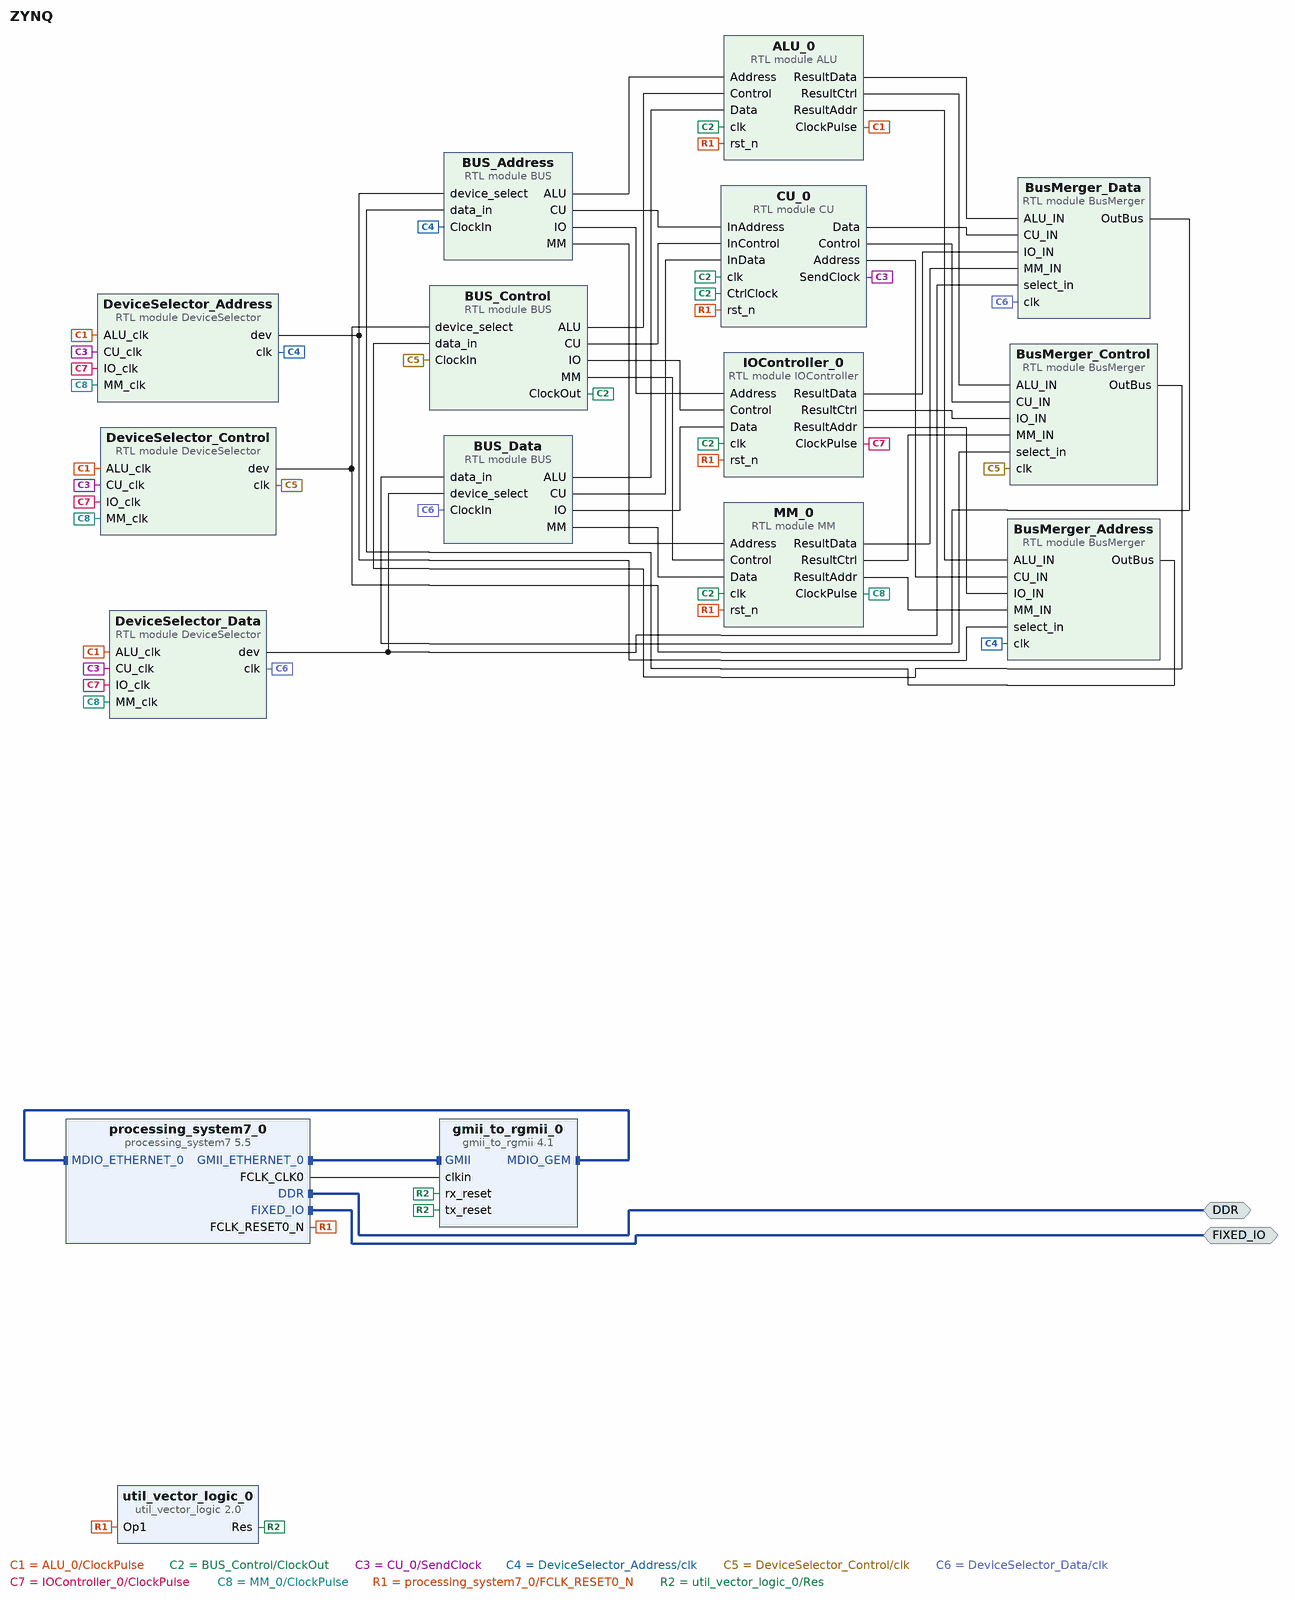
[diagram p0: block diagram of the top level]
# Vivado block design ZYNQ, xc7z020clg484-1, Vivado 2024.1
create_bd_design ZYNQ

create_bd_intf_port -mode Master -vlnv xilinx.com:interface:ddrx_rtl:1.0 DDR
create_bd_intf_port -mode Master -vlnv xilinx.com:display_processing_system7:fixedio_rtl:1.0 FIXED_IO

create_bd_cell -type ip -vlnv xilinx.com:ip:gmii_to_rgmii:4.1 gmii_to_rgmii_0
set_property -dict {CONFIG.SupportLevel Include_Shared_Logic_in_Core} [get_bd_cells gmii_to_rgmii_0]
create_bd_cell -type ip -vlnv xilinx.com:ip:processing_system7:5.5 processing_system7_0
set_property -dict [list \
  CONFIG.PCW_APU_PERIPHERAL_FREQMHZ 666.666666 \
  CONFIG.PCW_ENET0_ENET0_IO EMIO \
  CONFIG.PCW_ENET0_GRP_MDIO_ENABLE 1 \
  CONFIG.PCW_ENET0_GRP_MDIO_IO EMIO \
  CONFIG.PCW_ENET0_PERIPHERAL_ENABLE 1 \
  CONFIG.PCW_ENET1_PERIPHERAL_CLKSRC External \
  CONFIG.PCW_ENET_RESET_ENABLE 0 \
  CONFIG.PCW_FPGA0_PERIPHERAL_FREQMHZ 200 \
  CONFIG.PCW_FPGA1_PERIPHERAL_FREQMHZ 50 \
  CONFIG.PCW_GPIO_MIO_GPIO_ENABLE 1 \
  CONFIG.PCW_GPIO_MIO_GPIO_IO MIO \
  CONFIG.PCW_I2C_RESET_ENABLE 0 \
  CONFIG.PCW_PERIPHERAL_BOARD_PRESET None \
  CONFIG.PCW_PRESET_BANK1_VOLTAGE {LVCMOS 3.3V} \
  CONFIG.PCW_QSPI_PERIPHERAL_ENABLE 0 \
  CONFIG.PCW_SD0_GRP_CD_ENABLE 0 \
  CONFIG.PCW_SD0_GRP_WP_ENABLE 0 \
  CONFIG.PCW_SD0_PERIPHERAL_ENABLE 1 \
  CONFIG.PCW_SD0_SD0_IO {MIO 40 .. 45} \
  CONFIG.PCW_SDIO_PERIPHERAL_FREQMHZ 100 \
  CONFIG.PCW_UART0_PERIPHERAL_ENABLE 1 \
  CONFIG.PCW_UART0_UART0_IO EMIO \
  CONFIG.PCW_UART1_PERIPHERAL_ENABLE 0 \
  CONFIG.PCW_UART_PERIPHERAL_FREQMHZ 100 \
  CONFIG.PCW_UIPARAM_DDR_BUS_WIDTH {16 Bit} \
  CONFIG.PCW_UIPARAM_DDR_FREQ_MHZ 533.333333 \
  CONFIG.PCW_UIPARAM_DDR_PARTNO {MT41K256M16 RE-125} \
  CONFIG.PCW_USB0_PERIPHERAL_ENABLE 1 \
  CONFIG.PCW_USB0_RESET_ENABLE 1 \
  CONFIG.PCW_USB0_RESET_IO {MIO 46} \
  CONFIG.PCW_USB0_USB0_IO {MIO 28 .. 39} \
  CONFIG.PCW_USB_RESET_ENABLE 1 \
  CONFIG.PCW_USB_RESET_SELECT {Share reset pin} \
  CONFIG.PCW_USE_M_AXI_GP0 0 \
] [get_bd_cells processing_system7_0]
# 495 more settings of processing_system7_0 are not shown: defaults, MIO pin electricals, DDR timing, and values the tool derives
create_bd_cell -type ip -vlnv xilinx.com:ip:util_vector_logic:2.0 util_vector_logic_0
set_property -dict {CONFIG.C_OPERATION not CONFIG.C_SIZE 1} [get_bd_cells util_vector_logic_0]
create_bd_cell -type module -reference BUS BUS_Control
create_bd_cell -type module -reference BUS BUS_Data
create_bd_cell -type module -reference BUS BUS_Address
create_bd_cell -type module -reference CU CU_0
create_bd_cell -type module -reference ALU ALU_0
create_bd_cell -type module -reference MM MM_0
create_bd_cell -type module -reference BusMerger BusMerger_Data
create_bd_cell -type module -reference DeviceSelector DeviceSelector_Data
create_bd_cell -type module -reference BusMerger BusMerger_Control
create_bd_cell -type module -reference BusMerger BusMerger_Address
create_bd_cell -type module -reference DeviceSelector DeviceSelector_Control
create_bd_cell -type module -reference DeviceSelector DeviceSelector_Address
create_bd_cell -type module -reference IOController IOController_0

# ---- connections ----

connect_bd_intf_net [get_bd_intf_ports DDR] [get_bd_intf_pins processing_system7_0/DDR]
connect_bd_intf_net [get_bd_intf_ports FIXED_IO] [get_bd_intf_pins processing_system7_0/FIXED_IO]
connect_bd_intf_net [get_bd_intf_pins processing_system7_0/GMII_ETHERNET_0] [get_bd_intf_pins gmii_to_rgmii_0/GMII]
connect_bd_intf_net [get_bd_intf_pins gmii_to_rgmii_0/MDIO_GEM] [get_bd_intf_pins processing_system7_0/MDIO_ETHERNET_0]
connect_bd_net [get_bd_pins ALU_0/ClockPulse] \
  [get_bd_pins DeviceSelector_Data/ALU_clk] [get_bd_pins DeviceSelector_Address/ALU_clk] \
  [get_bd_pins DeviceSelector_Control/ALU_clk]
connect_bd_net [get_bd_pins ALU_0/ResultAddr] [get_bd_pins BusMerger_Address/ALU_IN]
connect_bd_net [get_bd_pins ALU_0/ResultCtrl] [get_bd_pins BusMerger_Control/ALU_IN]
connect_bd_net [get_bd_pins ALU_0/ResultData] [get_bd_pins BusMerger_Data/ALU_IN]
connect_bd_net [get_bd_pins BUS_Address/ALU] [get_bd_pins ALU_0/Address]
connect_bd_net [get_bd_pins BUS_Address/CU] [get_bd_pins CU_0/InAddress]
connect_bd_net [get_bd_pins BUS_Address/IO] [get_bd_pins IOController_0/Address]
connect_bd_net [get_bd_pins BUS_Address/MM] [get_bd_pins MM_0/Address]
connect_bd_net [get_bd_pins BUS_Control/ALU] [get_bd_pins ALU_0/Control]
connect_bd_net [get_bd_pins BUS_Control/CU] [get_bd_pins CU_0/InControl]
connect_bd_net [get_bd_pins BUS_Control/ClockOut] \
  [get_bd_pins ALU_0/clk] [get_bd_pins IOController_0/clk] [get_bd_pins MM_0/clk] [get_bd_pins CU_0/clk] \
  [get_bd_pins CU_0/CtrlClock]
connect_bd_net [get_bd_pins BUS_Control/IO] [get_bd_pins IOController_0/Control]
connect_bd_net [get_bd_pins BUS_Control/MM] [get_bd_pins MM_0/Control]
connect_bd_net [get_bd_pins BUS_Data/ALU] [get_bd_pins ALU_0/Data]
connect_bd_net [get_bd_pins BUS_Data/CU] [get_bd_pins CU_0/InData]
connect_bd_net [get_bd_pins BUS_Data/IO] [get_bd_pins IOController_0/Data]
connect_bd_net [get_bd_pins BUS_Data/MM] [get_bd_pins MM_0/Data]
connect_bd_net [get_bd_pins BusMerger_Address/OutBus] [get_bd_pins BUS_Address/data_in]
connect_bd_net [get_bd_pins BusMerger_Control/OutBus] [get_bd_pins BUS_Control/data_in]
connect_bd_net [get_bd_pins BusMerger_Data/OutBus] [get_bd_pins BUS_Data/data_in]
connect_bd_net [get_bd_pins CU_0/Address] [get_bd_pins BusMerger_Address/CU_IN]
connect_bd_net [get_bd_pins CU_0/Control] [get_bd_pins BusMerger_Control/CU_IN]
connect_bd_net [get_bd_pins CU_0/Data] [get_bd_pins BusMerger_Data/CU_IN]
connect_bd_net [get_bd_pins CU_0/SendClock] \
  [get_bd_pins DeviceSelector_Data/CU_clk] [get_bd_pins DeviceSelector_Address/CU_clk] \
  [get_bd_pins DeviceSelector_Control/CU_clk]
connect_bd_net [get_bd_pins DeviceSelector_Address/clk] [get_bd_pins BUS_Address/ClockIn] [get_bd_pins BusMerger_Address/clk]
connect_bd_net [get_bd_pins DeviceSelector_Address/dev] [get_bd_pins BUS_Address/device_select] [get_bd_pins BusMerger_Address/select_in]
connect_bd_net [get_bd_pins DeviceSelector_Control/clk] [get_bd_pins BUS_Control/ClockIn] [get_bd_pins BusMerger_Control/clk]
connect_bd_net [get_bd_pins DeviceSelector_Control/dev] [get_bd_pins BUS_Control/device_select] [get_bd_pins BusMerger_Control/select_in]
connect_bd_net [get_bd_pins DeviceSelector_Data/clk] [get_bd_pins BUS_Data/ClockIn] [get_bd_pins BusMerger_Data/clk]
connect_bd_net [get_bd_pins DeviceSelector_Data/dev] [get_bd_pins BUS_Data/device_select] [get_bd_pins BusMerger_Data/select_in]
connect_bd_net [get_bd_pins IOController_0/ResultAddr] [get_bd_pins BusMerger_Address/IO_IN]
connect_bd_net [get_bd_pins IOController_0/ResultCtrl] [get_bd_pins BusMerger_Control/IO_IN]
connect_bd_net [get_bd_pins IOController_0/ResultData] [get_bd_pins BusMerger_Data/IO_IN]
connect_bd_net -net IOController_0_SendClock [get_bd_pins IOController_0/ClockPulse] \
  [get_bd_pins DeviceSelector_Data/IO_clk] [get_bd_pins DeviceSelector_Address/IO_clk] \
  [get_bd_pins DeviceSelector_Control/IO_clk]
connect_bd_net [get_bd_pins MM_0/ClockPulse] \
  [get_bd_pins DeviceSelector_Data/MM_clk] [get_bd_pins DeviceSelector_Address/MM_clk] \
  [get_bd_pins DeviceSelector_Control/MM_clk]
connect_bd_net [get_bd_pins MM_0/ResultAddr] [get_bd_pins BusMerger_Address/MM_IN]
connect_bd_net [get_bd_pins MM_0/ResultCtrl] [get_bd_pins BusMerger_Control/MM_IN]
connect_bd_net [get_bd_pins MM_0/ResultData] [get_bd_pins BusMerger_Data/MM_IN]
connect_bd_net [get_bd_pins processing_system7_0/FCLK_CLK0] [get_bd_pins gmii_to_rgmii_0/clkin]
connect_bd_net [get_bd_pins processing_system7_0/FCLK_RESET0_N] \
  [get_bd_pins util_vector_logic_0/Op1] [get_bd_pins ALU_0/rst_n] [get_bd_pins IOController_0/rst_n] [get_bd_pins MM_0/rst_n] \
  [get_bd_pins CU_0/rst_n]
connect_bd_net [get_bd_pins util_vector_logic_0/Res] [get_bd_pins gmii_to_rgmii_0/rx_reset] [get_bd_pins gmii_to_rgmii_0/tx_reset]

validate_bd_design
save_bd_design
